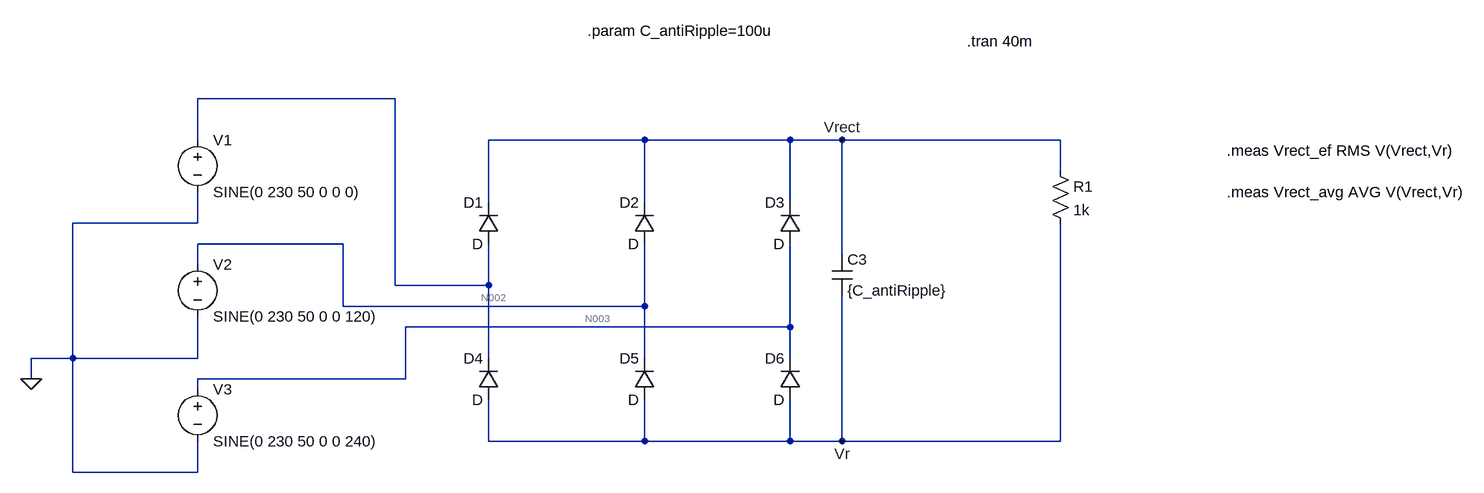
[diagram p0: schematic FullWaveRectfier.asc]
FullWaveRectfier.asc, the LTspice schematic file:
Version 4
SHEET 1 2520 680
WIRE -160 -80 -464 -80
WIRE -464 -16 -464 -80
WIRE 224 -16 -16 -16
WIRE 448 -16 224 -16
WIRE 528 -16 448 -16
WIRE 864 -16 528 -16
WIRE 864 32 864 -16
WIRE -16 80 -16 -16
WIRE 224 80 224 -16
WIRE 448 80 448 -16
WIRE -464 112 -464 64
WIRE -464 112 -656 112
WIRE -240 144 -464 144
WIRE 528 160 528 -16
WIRE -464 176 -464 144
WIRE -160 208 -160 -80
WIRE -16 208 -16 144
WIRE -16 208 -160 208
WIRE -240 240 -240 144
WIRE 224 240 224 144
WIRE 224 240 -240 240
WIRE 448 272 448 144
WIRE 448 272 -144 272
WIRE -656 320 -656 112
WIRE -656 320 -720 320
WIRE -464 320 -464 256
WIRE -464 320 -656 320
WIRE -16 320 -16 208
WIRE 224 320 224 240
WIRE 448 320 448 272
WIRE -720 352 -720 320
WIRE -144 352 -144 272
WIRE -144 352 -464 352
WIRE -464 368 -464 352
WIRE -16 448 -16 384
WIRE 224 448 224 384
WIRE 224 448 -16 448
WIRE 448 448 448 384
WIRE 448 448 224 448
WIRE 528 448 528 224
WIRE 528 448 448 448
WIRE 864 448 864 112
WIRE 864 448 528 448
WIRE -656 496 -656 320
WIRE -464 496 -464 448
WIRE -464 496 -656 496
FLAG 528 -16 Vrect
FLAG 528 448 Vr
FLAG -720 352 0
SYMBOL diode 0 144 R180
WINDOW 0 24 64 Left 2
WINDOW 3 24 0 Left 2
SYMATTR InstName D1
SYMBOL diode 240 144 R180
WINDOW 0 24 64 Left 2
WINDOW 3 24 0 Left 2
SYMATTR InstName D2
SYMBOL diode 464 144 R180
WINDOW 0 24 64 Left 2
WINDOW 3 24 0 Left 2
SYMATTR InstName D3
SYMBOL diode 0 384 R180
WINDOW 0 24 64 Left 2
WINDOW 3 24 0 Left 2
SYMATTR InstName D4
SYMBOL diode 240 384 R180
WINDOW 0 24 64 Left 2
WINDOW 3 24 0 Left 2
SYMATTR InstName D5
SYMBOL diode 464 384 R180
WINDOW 0 24 64 Left 2
WINDOW 3 24 0 Left 2
SYMATTR InstName D6
SYMBOL voltage -464 -32 R0
WINDOW 123 0 0 Left 0
WINDOW 39 0 0 Left 0
SYMATTR InstName V1
SYMATTR Value SINE(0 230 50 0 0 0)
SYMBOL voltage -464 160 R0
WINDOW 123 0 0 Left 0
WINDOW 39 0 0 Left 0
SYMATTR InstName V2
SYMATTR Value SINE(0 230 50 0 0 120)
SYMBOL voltage -464 352 R0
WINDOW 123 0 0 Left 0
WINDOW 39 0 0 Left 0
SYMATTR InstName V3
SYMATTR Value SINE(0 230 50 0 0 240)
SYMBOL cap 512 160 R0
SYMATTR InstName C3
SYMATTR Value {C_antiRipple}
SYMBOL res 848 16 R0
SYMATTR InstName R1
SYMATTR Value 1k
TEXT 720 -168 Left 2 !.tran 40m
TEXT 136 -184 Left 2 !.param C_antiRipple=100u
TEXT 1120 0 Left 2 !.meas Vrect_ef RMS V(Vrect,Vr)
TEXT 1120 64 Left 2 !.meas Vrect_avg AVG V(Vrect,Vr)

The netlist it stands for:
* FullWaveRectfier.asc
D1 N001 Vrect D
D2 N002 Vrect D
D3 N003 Vrect D
D4 Vr N001 D
D5 Vr N002 D
D6 Vr N003 D
V1 N001 0 SINE(0 230 50 0 0 0)
V2 N002 0 SINE(0 230 50 0 0 120)
V3 N003 0 SINE(0 230 50 0 0 240)
C3 Vrect Vr {C_antiRipple}
R1 Vrect Vr 1k
.model D D
.lib standard.dio
.tran 40m
.param C_antiRipple=100u
.meas Vrect_ef RMS V(Vrect,Vr)
.meas Vrect_avg AVG V(Vrect,Vr)
.backanno
.end

* Results of the author's LTspice run, read from the files saved beside the schematic
* Operating Point, zero values left out:
*   V(vrect) = 198.4 V
*   V(n002) = 199.2 V
*   V(n003) = -199.2 V
*   V(vr) = -198.4 V
*   I(D1) = -198.4 pA
*   I(D2) = 396.8 mA
*   I(D3) = -397.6 pA
*   I(D4) = -198.4 pA
*   I(D5) = -397.6 pA
*   I(D6) = 396.8 mA
*   I(R1) = 396.8 mA
*   I(V2) = -396.8 mA
*   I(V3) = 396.8 mA
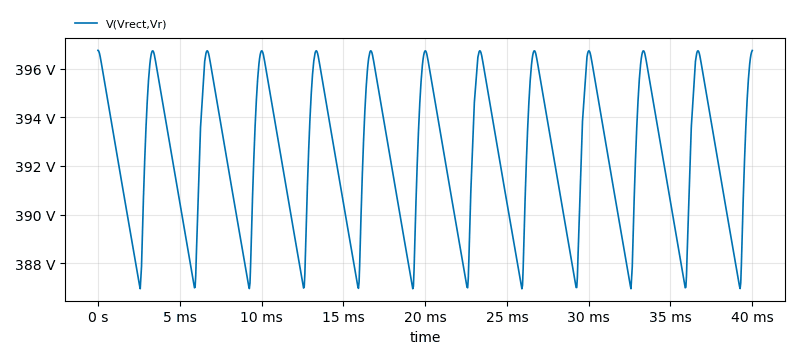
[diagram p1: Transient Analysis of FullWaveRectfier.asc, plotted from the saved traces]
* Transient Analysis, 1 run:
*   V(Vrect,Vr): min 386.9 V, max 396.8 V, average 392.2 V, rms 392.2 V, last 396.7 V
* From the log:
*   vrect_ef: RMS(v(vrect,vr))=392.218 FROM 0 TO 0.04
*   vrect_avg: AVG(v(vrect,vr))=392.207 FROM 0 TO 0.04